# Altium schematic sheet Control_ESP32.SchDoc
size A4
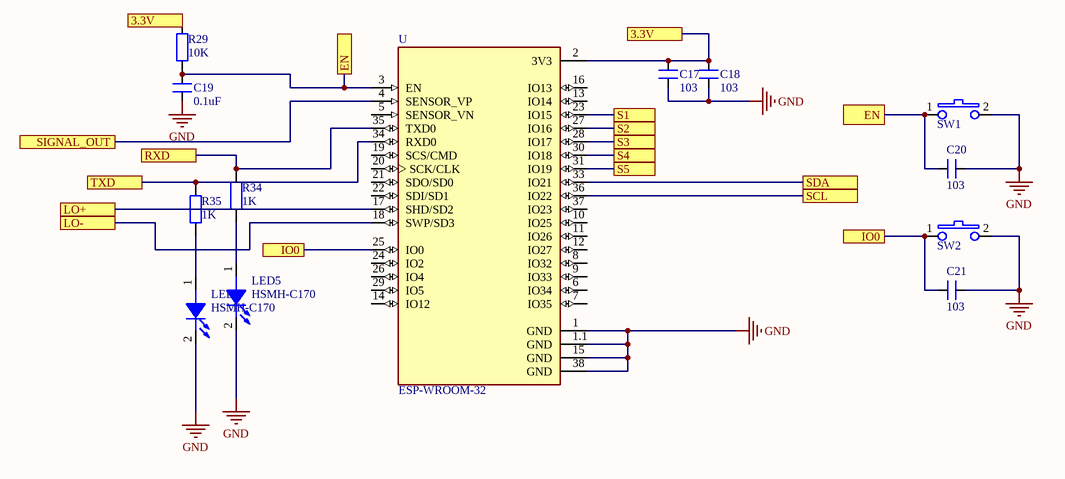
[diagram p0: Control_ESP32.SchDoc]

## Parts
C17  103  [SM-0805]
C18  103  [SM-0805]
C19  0.1uF  [SM-0805]
C20  103  [SM-0805]
C21  103  [SM-0805]
LED5  HSMH-C170  [LED.SMD.RED]
LED6  HSMH-C170  [LED.SMD.RED]
R29  value 10K  [DIEN TRO 0805]  (hidden comment: RES_SMD_0805)
R34  value 1K  [DIEN TRO 0805]  (hidden comment: RES_SMD_0805)
R35  value 1K  [DIEN TRO 0805]  (hidden comment: RES_SMD_0805)
SW1  PTS635  [TactSwitches.PTS635.SMT]  (value not drawn)
SW2  PTS635  [TactSwitches.PTS635.SMT]  (value not drawn)
U  ESP-WROOM-32  [MODULE_ESP-WROOM-32]

## Ports
3.3V, EN, IO0, LO+, LO-, RXD, S1, S2, S3, S4, S5, SCL, SDA, SIGNAL_OUT, TXD

## Nets
GND: C17.2 C18.2 C19.2 C20.2 C21.2 LED5.2(K) LED6.2(K) SW1.2 SW2.2 U.1(GND) U.1.1(GND) U.15(GND) U.38(GND)
3.3V: C17.1 C18.1 R29.2 U.2(3V3) ; port 3.3V
EN: C19.1 C20.1 R29.1 SW1.1 U.3(EN) ; port EN
IO0: C21.1 SW2.1 U.25(IO0) ; port IO0
LO+: U.17(SHD/SD2) ; port LO+
LO-: U.18(SWP/SD3) ; port LO-
RXD: R34.1 U.35(TXD0) ; port RXD
S1: U.23(IO15) ; port S1
S2: U.27(IO16) ; port S2
S3: U.28(IO17) ; port S3
S4: U.30(IO18) ; port S4
S5: U.31(IO19) ; port S5
SCL: U.36(IO22) ; port SCL
SDA: U.33(IO21) ; port SDA
SIGNAL_OUT: U.4(SENSOR_VP) ; port SIGNAL_OUT
TXD: R35.1 U.34(RXD0) ; port TXD
NetLED5_1: LED5.1(A) R34.2
NetLED6_1: LED6.1(A) R35.2

Not connected (* = marked no-connect by the designer): U 5(SENSOR_VN) 6(IO34) 7(IO35) 8(IO32) 9(IO33) 10(IO25) 11(IO26) 12(IO27) 13(IO14) 14(IO12) 16(IO13) 19(SCS/CMD) 20(SCK/CLK) 21(SDO/SD0) 22(SDI/SD1) 24(IO2) 26(IO4) 29(IO5) 37(IO23)

## Library data of the parts
C17 C18 C20 C21 = CM: Cap SMD; Value: 103
C19 = CM: Cap SMD; Value: 103
LED5 LED6 = LED_1: Typical GaAs SMD LED; Manufacturer: Lite-On Inc; Color: RED; Type: Cong ty RP; Vendor: Digikey; Publisher: Hoang Nguyen; Price: *; Published: 13-April-2009; ComponentLink1Description: Digikey Part Link; ComponentLink2Description: Open Datasheet; ComponentLink2URL: H:\LIBRARY\LIBRARY.Datasheet\
R29 R34 R35 = RES_SMD_0805: RES_0805; Published: 8-Jun-2000; LatestRevisionDate: 17-Jul-2002; LatestRevisionNote: Re-released for DXP Platform.; PackageReference: AXIAL-0.4; Publisher: Altium Limited
SW1 SW2 = SW TACT MOM SPST: SWITCH TACT MOM SPST SMD; Manufacturer: C&K Components; Manufacturer P/N: PTS635SL25SMTR LFS; Vendor: Digikey; Vendor P/N: CKN9119CT-ND; ComponentLink1URL: http://search.digikey.com/scripts/DkSearch/dksus.dll?Detail&name=CKN1573CT-ND; ComponentLink2URL: H:\LIBRARY\LIBRARY.Datasheet\SBLCDA4_Specification.pdf; ComponentLink1Description: Digikey Part Link; ComponentLink2Description: Open Datasheet; Publisher: Hoang Nguyen; Published: 13-April-2009
U = ESP-WROOM-32: WiFi 802.11b/g/n/d/e/i Transceiver Module 2.4GHz Surface Mount; MF: Olimex LTD; Value: *; SnapEDA_Link: https://www.snapeda.com/parts/ESP-WROOM-32/Olimex%20LTD/view-part/2311927/?ref=snap; MP: ESP-WROOM-32; Availability: Unavailable; Price: None; Package: Module Olimex LTD